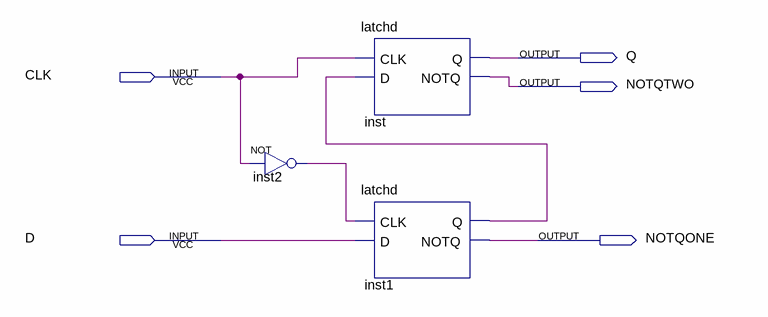
[diagram p0: schematic sheet]
// Quartus schematic flipflopd.bdf as structural Verilog: 3 symbols, 5 pins
module flipflopd (
  input  CLK,
  input  D,
  output Q,
  output NOTQTWO,
  output NOTQONE
);

  wire inst1_q, inst2_out;

  not inst2 (inst2_out, CLK);
  latchd inst (.CLK(CLK), .D(inst1_q), .Q(Q), .NOTQ(NOTQTWO));
  latchd inst1 (.CLK(inst2_out), .D(D), .Q(inst1_q), .NOTQ(NOTQONE));
endmodule
